# EAGLE design T05_version11_8 (EAGLE 7.1.0)
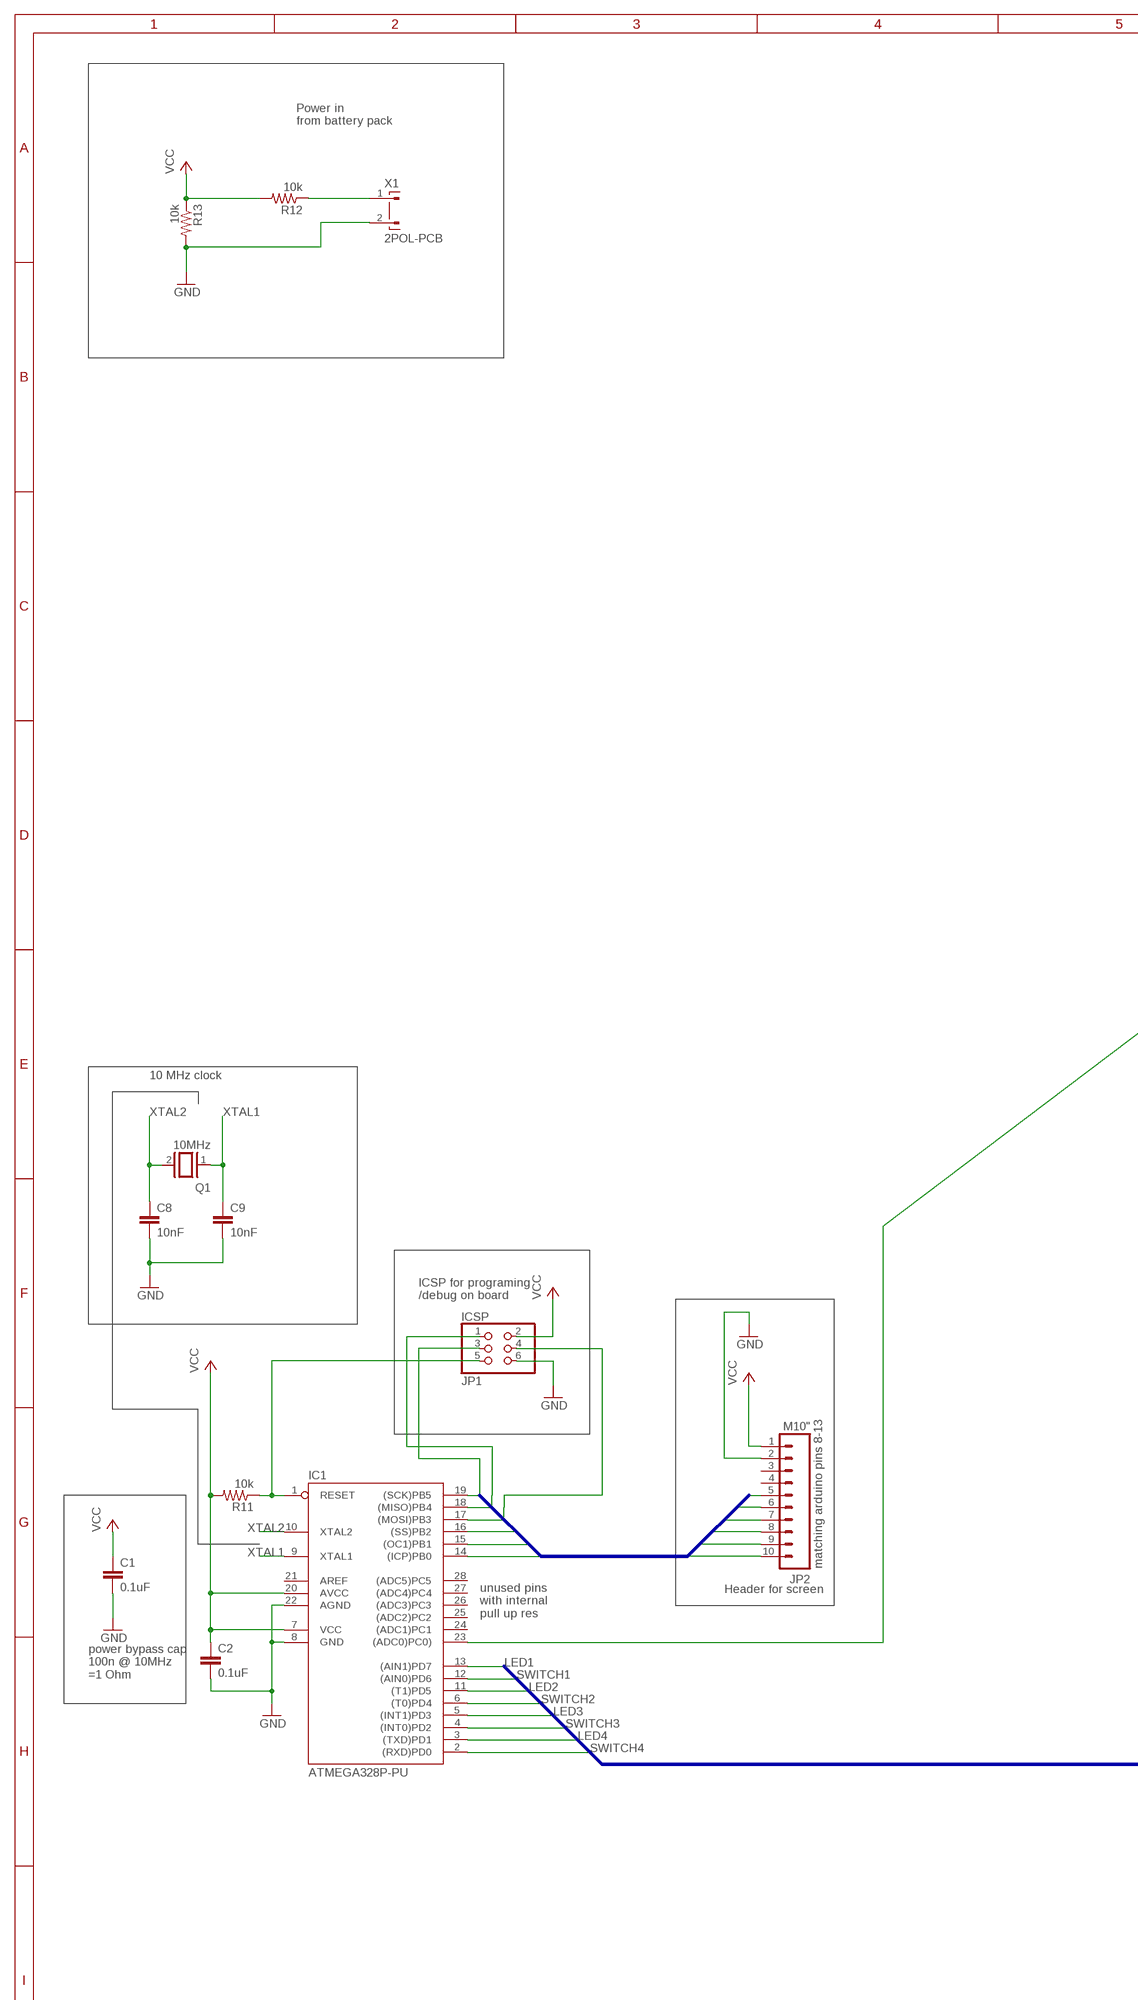
[diagram p0: schematic, sheet 1, part 1 of 2]
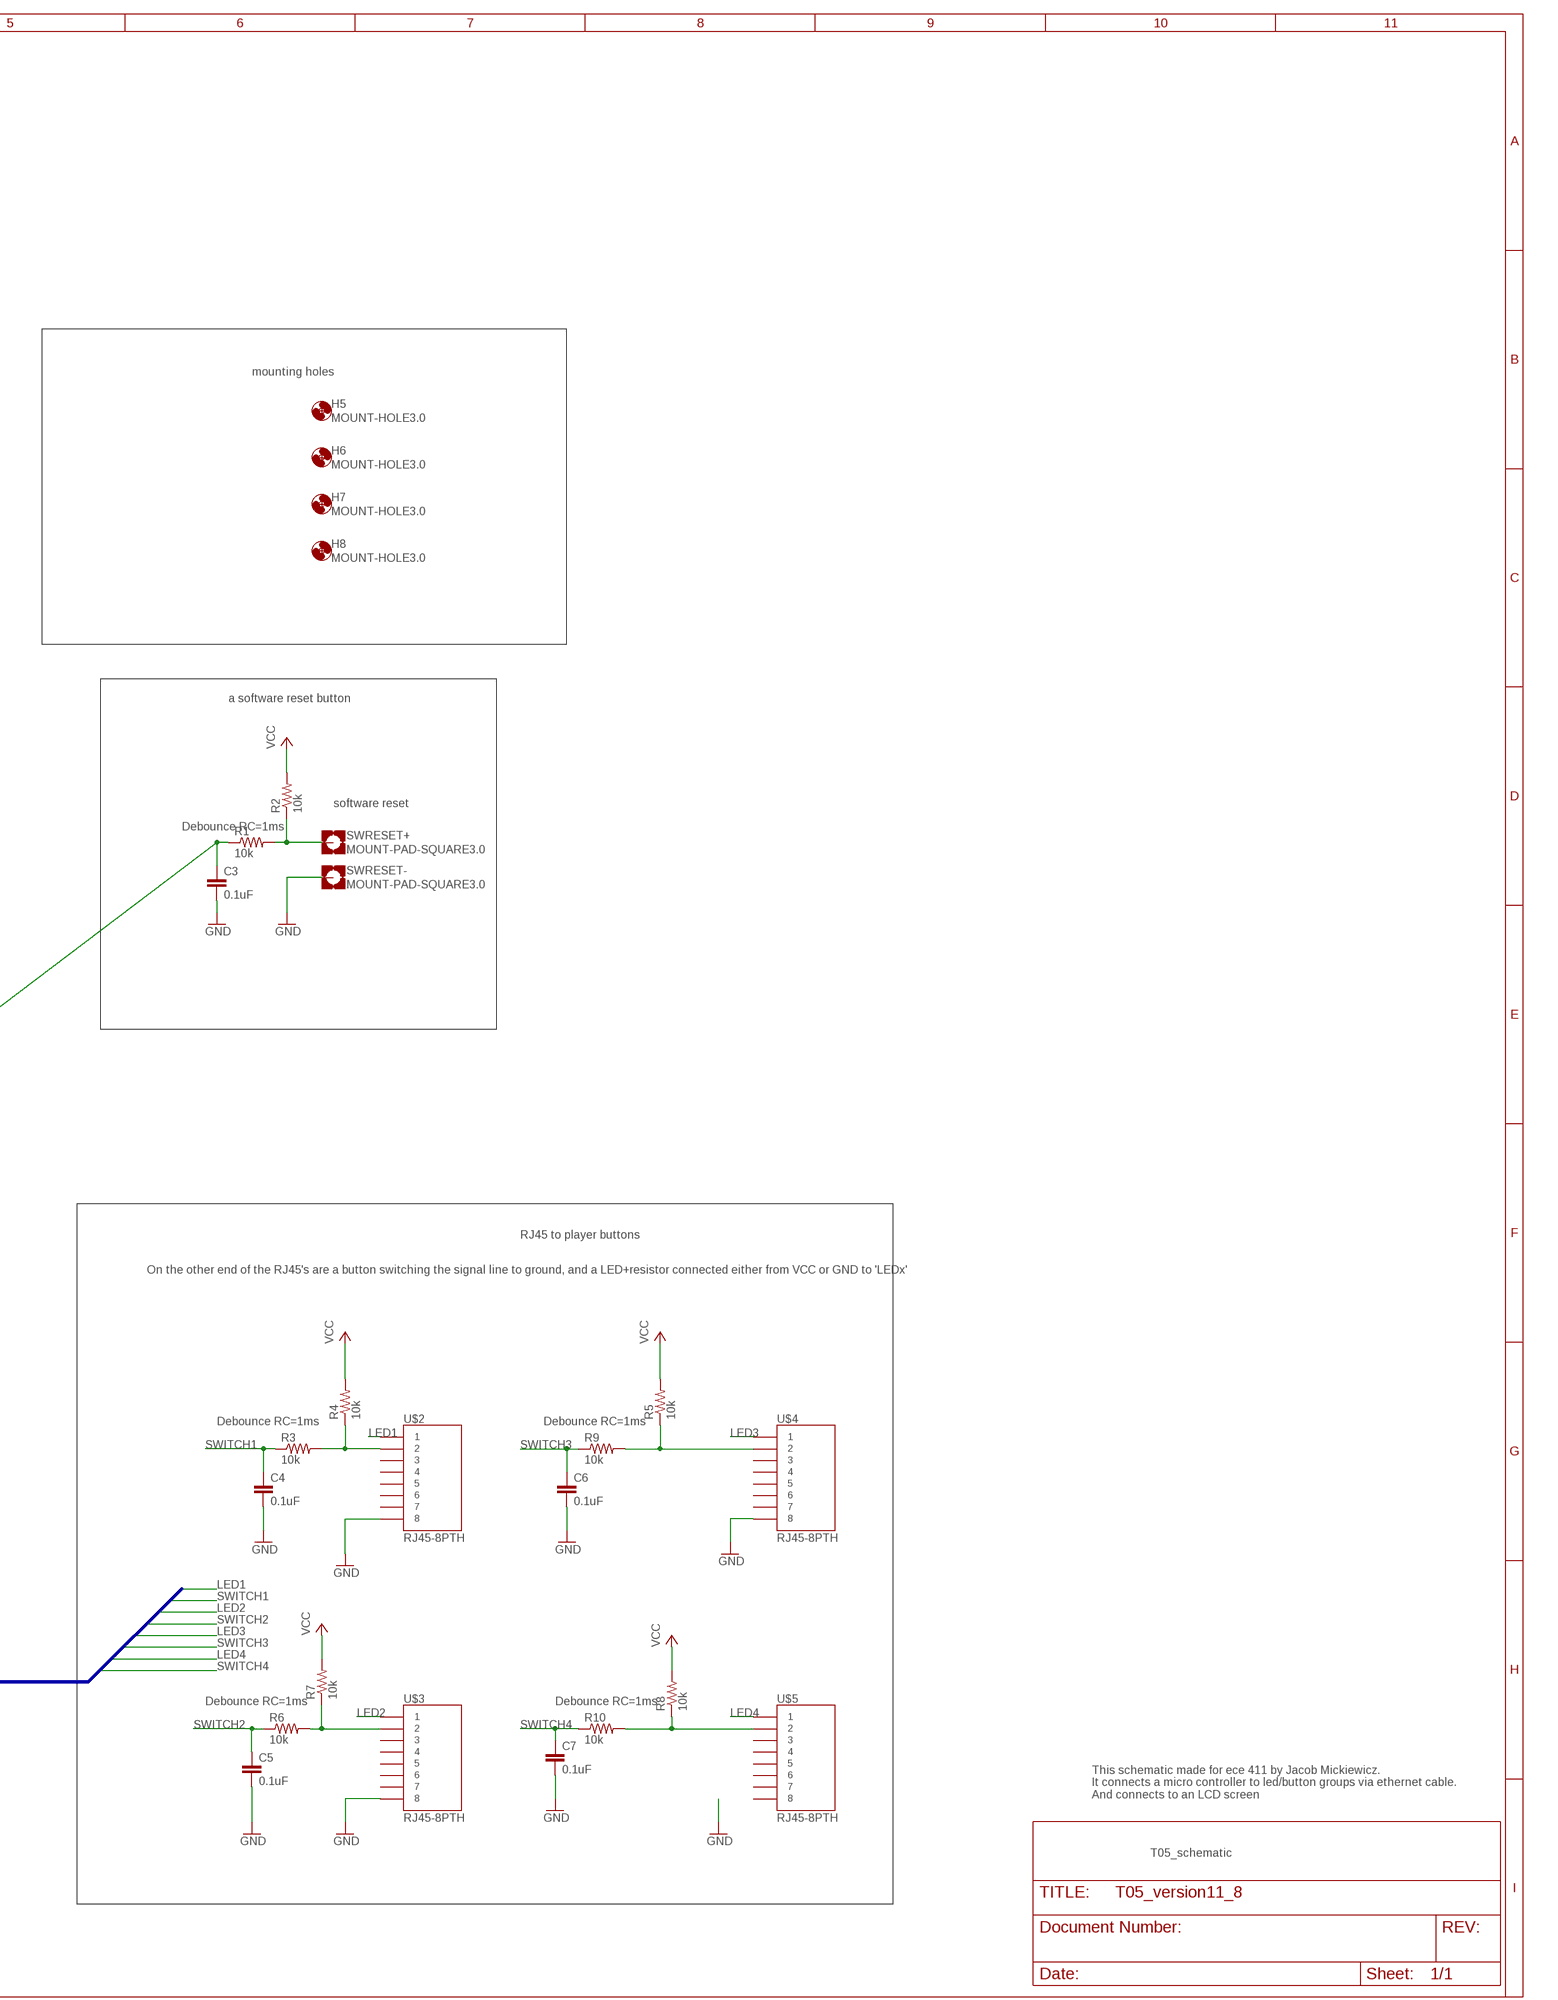
[diagram p1: schematic, sheet 1, part 2 of 2]

## Parts
C1  0.1uF  0.1UF-25V-5%(0603)  [0603-CAP]
C2  0.1uF  0.1UF-25V-5%(0603)  [0603-CAP]
C3  0.1uF  0.1UF-25V-5%(0603)  [0603-CAP]
C4  0.1uF  0.1UF-25V-5%(0603)  [0603-CAP]
C5  0.1uF  0.1UF-25V-5%(0603)  [0603-CAP]
C6  0.1uF  0.1UF-25V-5%(0603)  [0603-CAP]
C7  0.1uF  0.1UF-25V-5%(0603)  [0603-CAP]
C8  10nF  10NF/10000PF-50V-10%(0603)  [0603-CAP]
C9  10nF  10NF/10000PF-50V-10%(0603)  [0603-CAP]
H5  MOUNT-HOLE3.0  [3,0]
H6  MOUNT-HOLE3.0  [3,0]
H7  MOUNT-HOLE3.0  [3,0]
H8  MOUNT-HOLE3.0  [3,0]
IC1  ATMEGA328P-PU  [DIL28-3]
ICSP  JP1  PINHD-2X3  [2X03]
JP2  M10"  [1X10]
Q1  10MHz  XTAL/S  [QS]
R1  10k  RESISTOR0603-RES  [0603-RES]
R2  10k  RESISTOR0603-RES  [0603-RES]
R3  10k  RESISTOR0603-RES  [0603-RES]
R4  10k  RESISTOR0603-RES  [0603-RES]
R5  10k  RESISTOR0603-RES  [0603-RES]
R6  10k  RESISTOR0603-RES  [0603-RES]
R7  10k  RESISTOR0603-RES  [0603-RES]
R8  10k  RESISTOR0603-RES  [0603-RES]
R9  10k  RESISTOR0603-RES  [0603-RES]
R10  10k  RESISTOR0603-RES  [0603-RES]
R11  10k  RESISTOR0603-RES  [0603-RES]
R12  10k  RESISTOR0603-RES  [0603-RES]
R13  10k  RESISTOR0603-RES  [0603-RES]
SWRESET+  MOUNT-PAD-SQUARE3.0  [3,0-PAD-SQUARE]
SWRESET-  MOUNT-PAD-SQUARE3.0  [3,0-PAD-SQUARE]
U$2  RJ45-8PTH  [RJ45-8]
U$3  RJ45-8PTH  [RJ45-8]
U$4  RJ45-8PTH  [RJ45-8]
U$5  RJ45-8PTH  [RJ45-8]
X1  2POL-PCB  [2POL-PCB]

## Nets
GND [gnd]: C1.2 C2.2 C3.2 C4.2 C5.2 C6.2 C7.2 C8.2 C9.2 IC1.8(GND) IC1.22(AGND) ICSP.6 JP2.2 R13.2 SWRESET-.B3,0(MOUNT) U$2.8 U$3.8 U$4.8 X1.2
ICP: IC1.14((ICP)PB0) JP2.10
LED1: IC1.13((AIN1)PD7) U$2.1
LED2: IC1.11((T1)PD5) U$3.1
LED3: IC1.5((INT1)PD3) U$4.1
LED4: IC1.3((TXD)PD1) U$5.1
MISO: IC1.18((MISO)PB4) ICSP.1 JP2.6
MOSI: IC1.17((MOSI)PB3) ICSP.4 JP2.7
N$3: IC1.1(RESET) ICSP.5 R11.1
N$8: R3.2 R4.1 U$2.2
N$9: R8.1 R10.2 U$5.2
N$10: R1.2 R2.1 SWRESET+.B3,0(MOUNT)
N$12: R6.2 R7.1 U$3.2
N$13: R5.1 R9.2 U$4.2
N$16: R12.1 X1.1
OC1: IC1.15((OC1)PB1) JP2.9
SCK: IC1.19((SCK)PB5) ICSP.3 JP2.5
SS: IC1.16((SS)PB2) JP2.8
SW_RESET: C3.1 IC1.23((ADC0)PC0)) R1.1
SWITCH1: C4.1 IC1.12((AIN0)PD6) R3.1
SWITCH2: C5.1 IC1.6((T0)PD4) R6.1
SWITCH3: C6.1 IC1.4((INT0)PD2) R9.1
SWITCH4: C7.1 IC1.2((RXD)PD0) R10.1
VCC [vcc]: C1.1 C2.1 IC1.7(VCC) IC1.20(AVCC) ICSP.2 JP2.1 R2.2 R4.2 R5.2 R7.2 R8.2 R11.2 R12.2 R13.1
XTAL1: C9.1 IC1.9(XTAL1) Q1.1
XTAL2: C8.1 IC1.10(XTAL2) Q1.2
Unconnected: IC1.21(AREF) IC1.24((ADC1)PC1) IC1.25((ADC2)PC2) IC1.26((ADC3)PC3) IC1.27((ADC4)PC4) IC1.28((ADC5)PC5) JP2.3 JP2.4 U$2.3 U$2.4 U$2.5 U$2.6 U$2.7 U$3.3 U$3.4 U$3.5 U$3.6 U$3.7 U$4.3 U$4.4 U$4.5 U$4.6 U$4.7 U$5.3 U$5.4 U$5.5 U$5.6 U$5.7 U$5.8

## Buses
PLAYER_BUTTONS:LED[1..4],SWITCH[1..4]
PORT_B:SCK,MISO,MOSI,SS,OC1,ICP

## Notes on the sheet
- Power in
  from battery pack
- mounting holes
- a software reset button
- software reset
- Debounce RC=1ms
- 10 MHz clock
- ICSP for programing
  /debug on board
- RJ45 to player buttons
- On the other end of the RJ45's are a button switching the signal line to ground, and a LED+resistor connected either from VCC or GND to 'LEDx'
- Debounce RC=1ms | Debounce RC=1ms
- matching arduino pins 8-13
- Header for screen
- unused pins
  with internal 
  pull up res
- power bypass cap
  100n @ 10MHz
  =1 Ohm
- Debounce RC=1ms | Debounce RC=1ms
- This schematic made for ece 411 by Jacob Mickiewicz.
  It connects a micro controller to led/button groups via ethernet cable.
  And connects to an LCD screen
- T05_schematic

## Library data of the parts
C1-C7 = SparkFun-Capacitors:0.1UF-25V-5%(0603): CAP-08604; PROD_ID: CAP-08604
C8 C9 = SparkFun-Capacitors:10NF/10000PF-50V-10%(0603): CAP-00867; PROD_ID: CAP-00867
H5-H8 = holes:MOUNT-HOLE: MOUNTING HOLE with drill center marker
IC1 = SmartPrj:ATMEGA328P-: MICROCONTROLLER 4 Kbytes FLASH 128 bytes SRAM 256 bytes EEPROM UART 6-channel 10 bit ADC
ICSP = SparkFun-Connectors:PINHD-2X3: PIN HEADER
JP2 = SparkFun-Connectors:M10: Header 10 Standard 10-pin 0.1" header. Use with straight break away headers (SKU : PRT-00116), right angle break away headers (PRT-00553), swiss pins (PRT-00743), machine pins (PRT-00117), and female headers (PRT-00115).
Q1 = special:XTAL/S: CRYSTAL
R1-R13 = SparkFun-Passives:RESISTOR: Resistor Basic schematic elements and footprints for 0603, 1206, and PTH resistors.
SWRESET+ SWRESET- = holes:MOUNT-PAD-SQUARE: MOUNTING PAD, square
U$2-U$5 = SparkFun-Connectors:RJ45-8: RJ45 Jack Simple RJ45, 8-pin connection - connector for common Cat5, Cat5e, and Cat6 Ethernet cables. Footprint not yet proven in production. Connector sku is PRT-00643; Breakout PCB sku is BOB-00716.
X1 = con-friwo:2POL-PCB: PCB SUPPLY CONNECTOR FRIWO (TEXAS); OC_FARNELL: unknown; OC_NEWARK: unknown

## Net classes
0 default: width 0.254 mm, clearance 0.254 mm
1 vcc: width 1.27 mm, clearance 0.254 mm to class 0, clearance 0.254 mm
2 gnd: width 0.254 mm, clearance 0.508 mm to class 0, clearance 0.254 mm to class 1, clearance 0.254 mm

## Board
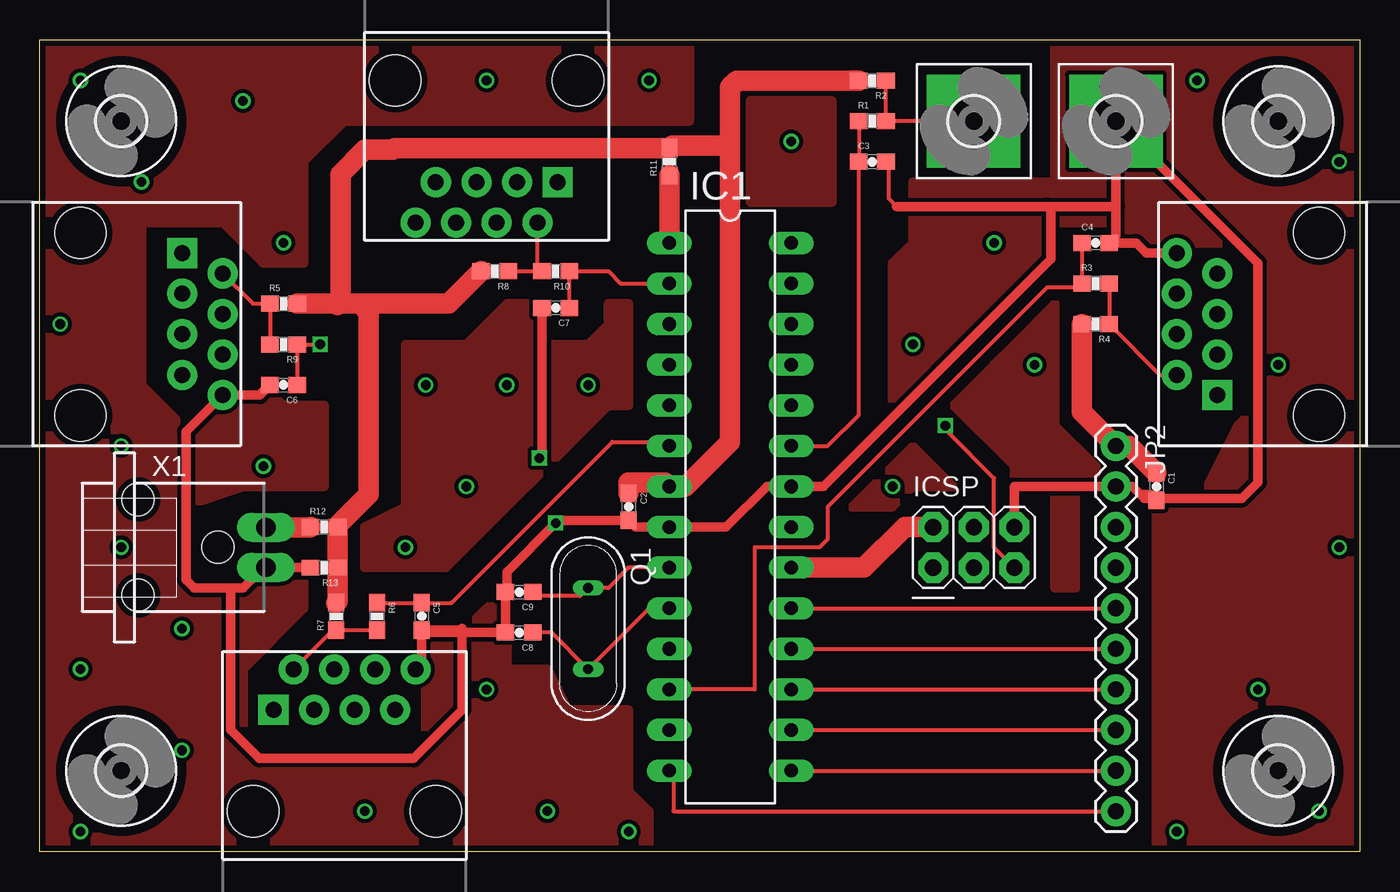
[diagram p2: board, top side]
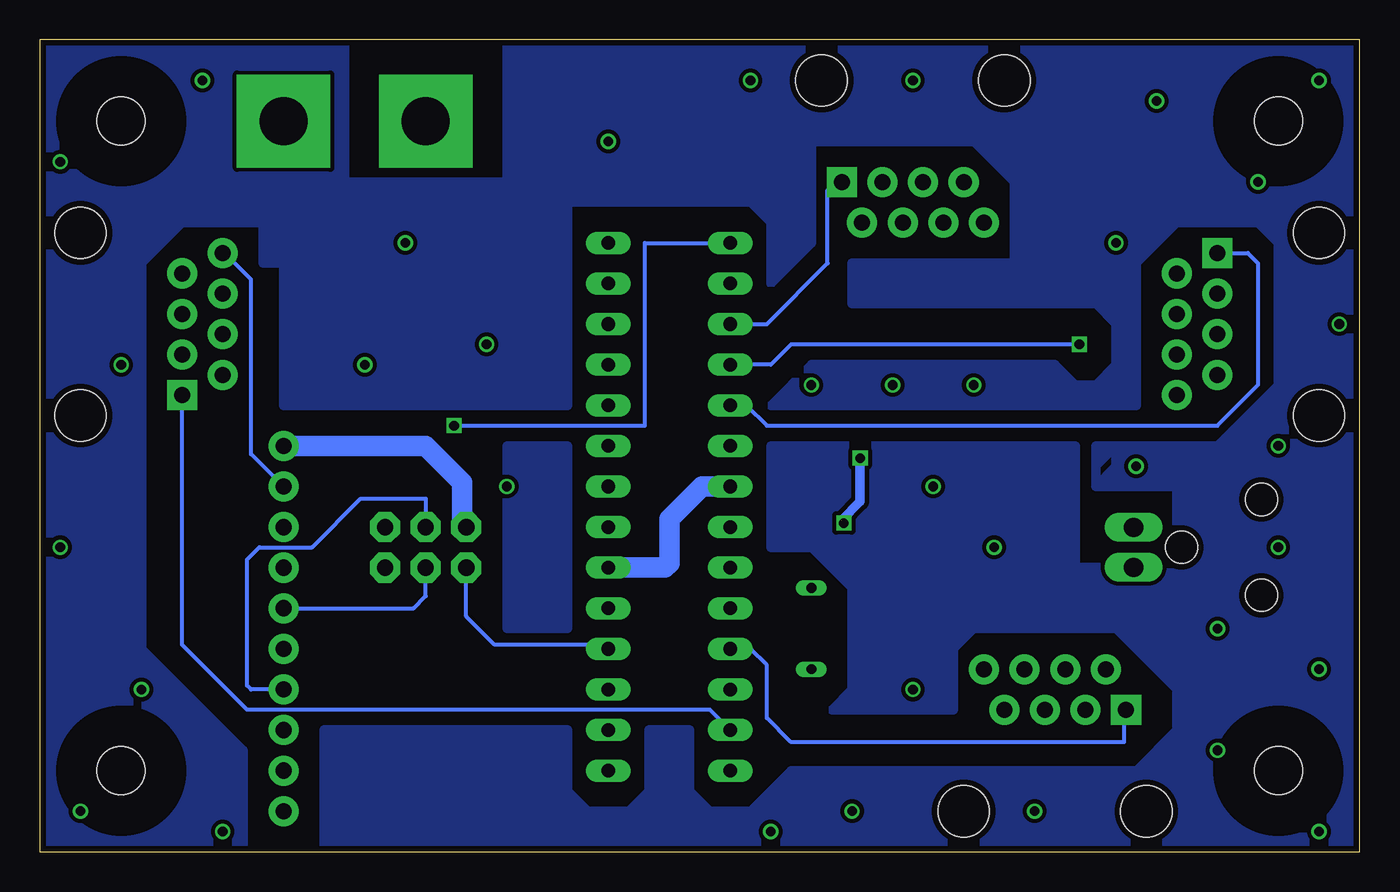
[diagram p3: board, bottom side, seen from below]

Size 82.55 x 50.8 mm. Coordinates in mm from the lower left corner, seen from the top.
Outline: 0,50.8 82.55,50.8 82.55,0 0,0 0,50.8
Copper layers (1*16): Top 0.0356mm / dielectric 1.5011mm / Bottom 0.0356mm
Design rules "OSH-Park-2-layer *": minimum track width 6mil, minimum drill 13mil, track to track 6mil, track to pad 6mil, pad to pad 6mil, via to via 6mil, smd to smd 6mil, copper to edge 15mil, drill to drill 10mil, minimum pad ring 7mil, minimum via ring 7mil, stop-mask expansion 3mil, vias tented up to drill 0mil, thermal gap 10mil

### Footprints (pad centres in the part's own frame; a part is rotated, then mirrored left to right if it is on the bottom)
0603-CAP = smd 1.1 x 1: 1 -0.85,0; 2 0.85,0
3,0 = hole 3: 0,0
DIL28-3 = drill 0.85 pad 1.422 long: 1 -16.51,-3.81; 2 -13.97,-3.81; 3 -11.43,-3.81; 4 -8.89,-3.81; 5 -6.35,-3.81; 6 -3.81,-3.81; 7 -1.27,-3.81; 8 1.27,-3.81; 9 3.81,-3.81; 10 6.35,-3.81; 11 8.89,-3.81; 12 11.43,-3.81; 13 13.97,-3.81; 14 16.51,-3.81; 15 16.51,3.81; 16 13.97,3.81; 17 11.43,3.81; 18 8.89,3.81; 19 6.35,3.81; 20 3.81,3.81; 21 1.27,3.81; 22 -1.27,3.81; 23 -3.81,3.81; 24 -6.35,3.81; 25 -8.89,3.81; 26 -11.43,3.81; 27 -13.97,3.81; 28 -16.51,3.81
2X03 = drill 1.016 pad 1.88 octagon: 1 -2.54,-1.27; 2 -2.54,1.27; 3 0,-1.27; 4 0,1.27; 5 2.54,-1.27; 6 2.54,1.27
1X10 = drill 1.016 pad 1.88: 1 0,0; 2 2.54,0; 3 5.08,0; 4 7.62,0; 5 10.16,0; 6 12.7,0; 7 15.24,0; 8 17.78,0; 9 20.32,0; 10 22.86,0
QS = drill 0.61 long: 1 -2.54,0; 2 2.54,0
0603-RES = smd 1.1 x 1: 1 -0.85,0; 2 0.85,0
3,0-PAD-SQUARE = drill 3 pad 5.842 square: B3,0 0,0
RJ45-8 = drill 1 pad 1.88 square: 1 -4.445,6.35 | drill 1 pad 1.88: 2 -3.175,8.89; 3 -1.905,6.35; 4 -0.635,8.89; 5 0.635,6.35; 6 1.905,8.89; 7 3.175,6.35; 8 4.445,8.89 | hole 3.2: -5.715,0; 5.715,0
2POL-PCB = drill 1.2 long: 1 -1.25,11.6; 2 1.25,11.6 | hole 2: -3,3.6; 3,3.6; 0,8.6

### Placement (x,y rotation side)
C1  69.85,22.86 270 top
C2  36.83,21.59 270 top
C3  52.07,43.18 0 top
C4  66.04,38.1 0 top
C5  23.88,14.73 270 top
C6  15.24,29.21 180 top
C7  32.26,34.04 180 top
C8  29.97,13.72 180 top
C9  29.97,16.26 180 top
H5  77.47,5.08 0 top
H6  77.47,45.72 0 top
H7  5.08,45.72 0 top
H8  5.08,5.08 0 top
IC1  43.18,21.59 270 top
ICSP  58.42,19.05 0 top
JP2  67.31,25.4 270 top
Q1  34.29,13.97 270 top
R1  52.07,45.72 0 top
R2  52.07,48.26 180 top
R3  66.04,35.56 0 top
R4  66.04,33.02 180 top
R5  15.24,34.29 0 top
R6  21.08,14.73 270 top
R7  18.54,14.73 90 top
R8  28.45,36.32 180 top
R9  15.24,31.75 180 top
R10  32.26,36.32 180 top
R11  39.37,43.18 90 top
R12  17.78,20.32 0 top
R13  17.78,17.78 180 top
SWRESET+  58.42,45.72 0 top
SWRESET-  67.31,45.72 0 top
U$2  80.01,33.02 90 top
U$3  19.05,2.54 0 top
U$4  2.54,33.02 270 top
U$5  27.94,48.26 180 top
X1  2.54,19.05 270 top

### Tracks (layer width: path | path; a pad name or v marks a point on that pad's centre or on a via)
GND  (via drill 0.6)  (1 unrouted)
  Top 0.254: C4.2 67.31,38.52 | C3.2 53.09,43.01 53.09,40.89 53.59,40.39 | C1.2 69.51,22.35 | C2.2 37.25,20.32 | U$3.8 23.88,11.81 | C5.2 24.04,13.72
  Top 0.61: C6.2 13.76,28.57 U$4.8 9.14,26.29 9.14,17.02 9.65,16.51 11.94,16.51 | 11.94,16.51 12.7,16.51 13.99,17.8 X1.2 14.16,17.78 R13.2 | C4.2 68.58,38.1 69.22,37.47 U$2.8 | 67.31,38.52 67.31,40.39 | 67.31,40.39 SWRESET-.B3,0 76.2,36.83 76.2,23.11 75.18,22.1 69.09,22.1 68.83,22.35 | 53.59,40.39 62.99,40.39 | 62.99,40.39 67.31,40.39 | 69.51,22.35 68.83,22.35 | 68.83,22.35 68.33,22.86 JP2.2 60.96,22.86 ICSP.6 | 37.25,20.32 IC1.8 42.93,20.32 45.47,22.86 IC1.22 49.02,22.86 63.25,37.08 63.25,40.13 62.99,40.39 | 23.88,11.81 C5.2 26.33,13.88 26.42,13.97 26.42,8.89 23.37,5.84 13.72,5.84 11.94,7.62 11.94,16.51 | 24.04,13.72 C8.2 C9.2 29.21,16.34 29.21,17.53 v32.26,20.57 32.42,20.74 C2.2 | C7.2 31.41,24.8 v31.24,24.64
  Bottom 0.254: JP2.2 69.34,24.89 69.34,35.81 70.61,37.08 70.61,37.47 U$2.8
  Bottom 0.61: v31.24,24.64 31.24,21.92 32.42,20.74
ICP
  Top 0.254: IC1.14 39.62,4.83 39.62,2.54 JP2.10
LED1
  Bottom 0.254: IC1.13 40.64,8.89 69.6,8.89 73.66,12.95 U$2.1
LED2
  Bottom 0.254: U$3.1 14.73,8.76 14.73,6.86 35.56,6.86 37.08,8.38 37.08,11.68 38.1,12.7 IC1.11
LED3
  Bottom 0.254: U$4.1 6.99,37.47 6.35,36.83 6.35,29.21 8.89,26.67 37.08,26.67 38.35,27.94 IC1.5
LED4
  Bottom 0.254: IC1.3 37.08,33.02 33.27,36.83 33.27,41.4 32.77,41.91 U$5.1
MISO
  Top 0.254: IC1.18 JP2.6
  Bottom 0.254: IC1.18 47.24,12.95 54.1,12.95 55.88,14.73 ICSP.1
MOSI
  Top 0.254: IC1.17 JP2.7
  Bottom 0.254: JP2.7 69.34,10.16 69.6,10.41 69.6,18.29 68.83,19.05 65.53,19.05 62.48,22.1 58.42,22.1 ICSP.4
N$1  (via drill 0.6)
  other vias: 56.64,26.67
N$2  (via drill 0.6)
  other vias: 17.53,31.75
N$3  (via drill 0.6)
  Top 0.254: ICSP.5 59.69,19.05 59.69,23.37 56.9,26.16 56.9,26.42 v56.64,26.67
  Top 1.27: IC1.1 R11.1
  Bottom 0.254: v56.64,26.67 44.7,26.67 44.7,38.1 IC1.1
N$6
  pour Top: 0,0 38.1,0 38.1,2.54 36.83,3.81 36.83,8.89 33.02,8.89 31.75,11.43 29.21,11.43 29.21,16.51 26.67,13.97 24.13,13.97 24.13,6.35 12.7,6.35 12.7,11.43 16.51,15.24 16.51,17.78 12.7,17.78 11.43,16.51 10.16,16.51 8.89,17.78 8.89,21.59 12.7,22.86 17.78,22.86 17.78,27.94 15.24,27.94 13.97,29.21 11.43,29.21 8.89,26.67 6.35,29.21 6.35,39.37 11.43,39.37 13.97,36.83 16.51,36.83 16.51,43.18 19.05,45.72 40.64,45.72 40.64,50.8 0,50.8
N$7
  pour Top: 20.32,20.32 20.32,17.78 25.4,17.78 35.56,27.94 36.83,27.94 36.83,34.29 35.56,34.29 35.56,33.02 34.29,31.75 31.75,31.75 31.75,34.29 29.21,34.29 27.94,33.02 26.67,31.75 22.86,31.75 22.86,22.86 22.86,21.59
N$8
  Top 0.254: R3.2 R4.1 70.06,29.84 U$2.2
N$9
  Top 0.254: R8.1 R10.2 31.11,36.62 U$5.2
N$10
  Top 0.254: SWRESET+.B3,0 R1.2 R2.1
N$11
  pour Top: 69.85,21.59 69.85,0 82.55,0 82.55,50.8 63.5,50.8 63.5,41.91 54.61,41.91 54.61,38.1 53.34,36.83 53.34,27.94 63.5,36.83 63.5,39.37 67.31,39.37 67.31,38.1 76.2,38.1 76.2,27.94 74.93,26.67 72.39,21.59
N$12
  Top 0.254: U$3.2 18.33,13.88 R7.1 R6.2
N$13
  Top 0.254: R9.2 R5.1 13.34,34.29 U$4.2
N$14
  pour Top: 44.45,46.99 49.53,46.99 49.53,40.64 45.72,40.64 44.45,40.64
N$15
  pour Top: 62.23,33.02 57.15,27.94 60.96,24.13 60.96,22.86 66.04,22.86 66.04,24.13 63.5,26.67 63.5,34.29 60.96,31.75 59.69,30.48 60.96,31.75
N$16
  Top 1.27: X1.1 16.91,20.3 R12.1
N$17
  pour Top: 63.5,22.86 63.5,16.51 64.77,16.51 64.77,22.86
N$18
  pour Top: 54.61,25.4 50.8,21.59 53.34,21.59 54.61,22.86 57.15,22.86
N$19
  pour Bottom: 67.31,41.91 67.31,27.94 49.53,27.94 49.53,41.91
N$20
  pour Bottom: 53.34,39.37 53.34,50.8 0,50.8 0,0 38.1,0 38.1,2.54 35.56,5.08 11.43,5.08 13.97,5.08 11.43,7.62 11.43,17.78 11.43,10.16 15.24,13.97 24.13,13.97 25.4,12.7 25.4,8.89 33.02,8.89 31.75,10.16 31.75,16.51 34.29,19.05 36.83,19.05 36.83,25.4 17.78,25.4 17.78,17.78 11.43,17.78 11.43,22.86 16.51,22.86 15.24,24.13 15.24,25.4 16.51,24.13 16.51,22.86 16.51,25.4 8.89,25.4 5.08,29.21 5.08,38.1 6.35,39.37 11.43,39.37 16.51,34.29 31.75,34.29 31.75,36.83 21.59,36.83 21.59,40.64 21.59,41.91 24.13,44.45 34.29,44.45 34.29,38.1 36.83,35.56 36.83,39.37 38.1,40.64 50.8,40.64 52.07,39.37
N$21
  pour Bottom: 34.29,30.48 36.83,27.94 13.97,27.94 13.97,39.37 16.51,39.37 16.51,34.29 15.24,33.02 15.24,30.48 16.51,29.21 17.78,29.21 19.05,30.48 20.32,30.48
N$22
  pour Bottom: 41.91,7.62 44.45,7.62 44.45,5.08 44.45,3.81 45.72,2.54 48.26,2.54 49.53,3.81 49.53,7.62 64.77,7.62 64.77,1.27 64.77,0 35.56,0 35.56,2.54 40.64,2.54 41.91,3.81
N$23  (via drill 0.6)
  other vias: 13.97,24.13
N$24
  pour Bottom: 49.53,25.4 53.34,25.4 53.34,15.24 53.34,13.97 49.53,13.97
N$26
  pour Bottom: 63.5,36.83 68.58,36.83 68.58,39.37 73.66,39.37 76.2,36.83 76.2,12.7 69.85,6.35 69.85,0 82.55,0 82.55,50.8 63.5,50.8
N$27  (via drill 0.6)
  other vias: 2.54,1.27
N$28  (via drill 0.6)
  other vias: 8.89,6.35
N$29  (via drill 0.6)
  other vias: 2.54,11.43
N$30  (via drill 0.6)
  other vias: 8.89,13.97
N$31  (via drill 0.6)
  other vias: 5.08,19.05
N$32  (via drill 0.6)
  other vias: 5.08,25.4
N$33  (via drill 0.6)
  other vias: 1.27,33.02
N$34  (via drill 0.6)
  other vias: 6.35,41.91
N$35  (via drill 0.6)
  other vias: 2.54,48.26
N$36  (via drill 0.6)
  other vias: 12.7,46.99
N$37  (via drill 0.6)
  other vias: 15.24,38.1
N$38  (via drill 0.6)
  other vias: 24.13,29.21
N$39  (via drill 0.6)
  other vias: 29.21,29.21
N$40  (via drill 0.6)
  other vias: 34.29,29.21
N$41  (via drill 0.6)
  other vias: 22.86,19.05
N$42  (via drill 0.6)
  other vias: 26.67,22.86
N$43  (via drill 0.6)
  other vias: 27.94,10.16
N$44  (via drill 0.6)
  other vias: 31.75,2.54
N$45  (via drill 0.6)
  other vias: 20.32,2.54
N$46  (via drill 0.6)
  other vias: 36.83,1.27
N$47  (via drill 0.6)
  other vias: 27.94,48.26
N$48  (via drill 0.6)
  other vias: 38.1,48.26
N$49  (via drill 0.6)
  other vias: 46.99,44.45
N$50  (via drill 0.6)
  other vias: 54.61,31.75
N$51  (via drill 0.6)
  other vias: 53.34,22.86
N$52  (via drill 0.6)
  other vias: 71.12,1.27
N$53  (via drill 0.6)
  other vias: 80.01,2.54
N$54  (via drill 0.6)
  other vias: 76.2,10.16
N$55  (via drill 0.6)
  other vias: 81.28,19.05
N$56  (via drill 0.6)
  other vias: 77.47,30.48
N$57  (via drill 0.6)
  other vias: 81.28,43.18
N$58  (via drill 0.6)
  other vias: 72.39,48.26
N$59  (via drill 0.6)
  other vias: 59.69,38.1
N$60  (via drill 0.6)
  other vias: 62.23,30.48
OC1
  Top 0.254: IC1.15 JP2.9
SCK
  Top 0.254: IC1.19 JP2.5
  Bottom 0.254: JP2.5 59.18,15.24 58.42,16 ICSP.3
SS
  Top 0.254: IC1.16 JP2.8
SW_RESET
  Top 0.254: R1.1 C3.1 51.22,27.34 49.28,25.4 IC1.23
SWITCH1
  Top 0.254: C4.1 R3.1 64.94,35.31 62.99,35.31 49.28,21.59 49.28,19.56 48.77,19.05 44.7,19.05 44.7,10.16 IC1.12
SWITCH2
  Top 0.254: R6.1 C5.1 25.74,15.58 35.81,25.65 39.12,25.65 IC1.6
SWITCH3  (via drill 0.6)
  Top 0.254: C6.1 R9.1 v17.53,31.75
  Bottom 0.254: v17.53,31.75 35.56,31.75 36.83,30.48 IC1.4
SWITCH4
  Top 0.254: C7.1 R10.1 35.56,36.32 36.32,35.56 IC1.2
VCC
  Top 1.27: IC1.20 51.56,17.78 54.1,20.32 ICSP.2 | R4.2 65.19,27.52 JP2.1 68.16,25.4 C1.1 | C2.1 36.83,23.11 39.12,23.11 IC1.7 40.39,22.86 43.18,25.65 43.18,44.2 | R2.2 43.6,48.26 43.18,47.84 43.18,44.2 | 43.18,44.2 39.54,44.2 R11.2 22.19,44.03 22.1,43.94 20.32,43.94 18.8,42.42 18.8,34.54 19.05,34.29 | R5.2 18.54,34.29 | 18.54,34.29 19.05,34.29 | 19.05,34.29 20.07,34.29 | 20.07,34.29 25.57,34.29 R8.2 | 18.63,34.2 18.54,34.29 | 20.07,34.29 20.57,33.78 20.57,22.35 18.63,20.41 R12.2 R13.1 18.63,15.67 R7.2
  Bottom 1.27: ICSP.2 56.13,20.57 56.13,23.11 58.42,25.4 JP2.1 | IC1.20 43.43,17.78 43.18,18.03 43.18,20.83 41.15,22.86 IC1.7
XTAL1
  Top 0.254: IC1.9 36.83,17.78 35.56,16.51 Q1.1 33.78,16 31.24,16 30.99,16.26 C9.1
XTAL2
  Top 0.254: IC1.10 38.1,15.24 Q1.2 32,13.72 C8.1

### Text on the board
tSilk: RJ45 | SW_reset GND | RJ45 | RJ45 | Clock 10MHz | power | debug | to screen | RJ45